# EAGLE design remote (EAGLE 9.2.2)
CNAME: Metronom - remote module; CREVISION: 2; DESIGNER: Piotr Wysocki
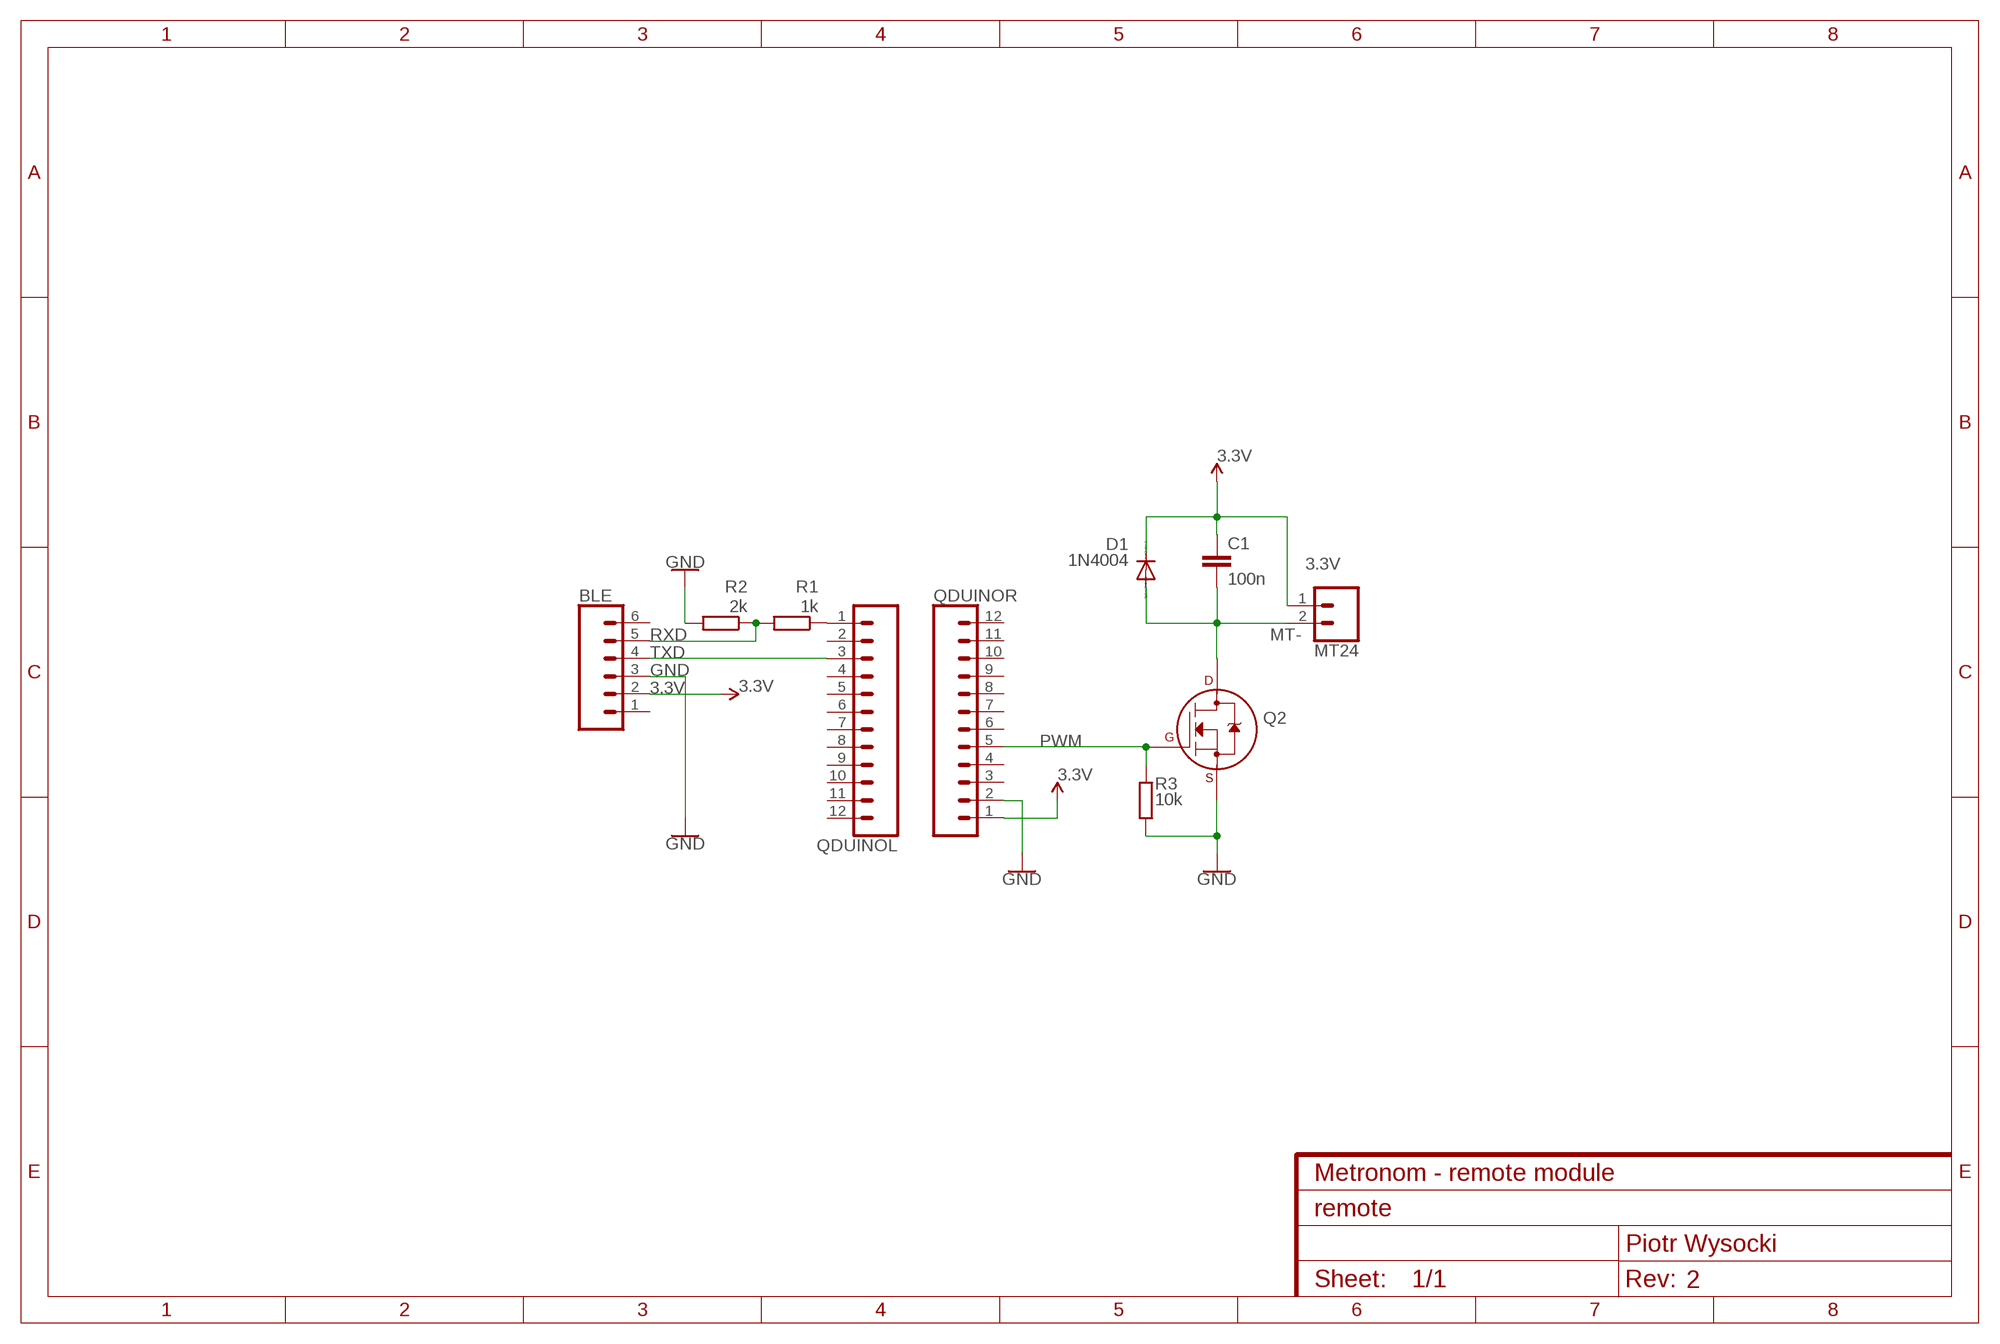
[diagram p0: schematic, sheet 1]

## Parts
BLE  CONN_06SILK_FEMALE_PTH  [1X06]
C1  100n  C-EU025-024X044  [C025-024X044]
D1  1N4004  [DO41-10]
MT24  CONN_02  [1X02]
Q2  2N7000_TO92  [TO-92]
QDUINOL  CONN_12  [1X12]
QDUINOR  CONN_12  [1X12]
R1  1k  R-EU_0204/7  [0204/7]
R2  2k  R-EU_0204/7  [0204/7]
R3  10k  R-EU_0204/7  [0204/7]

## Nets
3.3V: BLE.2 C1.1 D1.C MT24.1 QDUINOR.1
GND: BLE.3 Q2.1(S) QDUINOR.2 R2.2 R3.2
MT-: C1.2 D1.A MT24.2 Q2.3(D)
N$1: QDUINOL.1 R1.1
PWM: Q2.2(G) QDUINOR.5 R3.1
RXD: BLE.5 R1.2 R2.1
TXD: BLE.4 QDUINOL.3
Unconnected: BLE.1 BLE.6 QDUINOL.2 QDUINOL.4 QDUINOL.5 QDUINOL.6 QDUINOL.7 QDUINOL.8 QDUINOL.9 QDUINOL.10 QDUINOL.11 QDUINOL.12 QDUINOR.3 QDUINOR.4 QDUINOR.6 QDUINOR.7 QDUINOR.8 QDUINOR.9 QDUINOR.10 QDUINOR.11 QDUINOR.12

## Library data of the parts
BLE = SparkFun-Connectors:CONN_06: Multi connection point. Often used as Generic Header-pin footprint for 0.1 inch spaced/style header connections On any of the 0.1 inch spaced packages, you can populate with these: Break Away Headers - Straight <https://www.sparkfun.com/products/116> (PRT-00116) Break Away Male Headers - Right Angle <https://www.sparkfun.com/products/553> (PRT-00553) Female Headers <https://www.sparkfun.com/products/115> (PRT-00115) Break Away Headers - Machine Pin <https://www.sparkfun.com/products/117> (PRT-00117) Break Away Female Headers - Swiss Machine Pin <https://www.sparkfun.com/products/743> (PRT-00743) Arduino Stackable Header - 6 Pin <https://www.sparkfun.com/products/9280> (PRT-09280) For SCREWTERMINALS and SPRING TERMINALS visit here: Screw Terimnals on SparkFun.com <https://www.sparkfun.com/search/results?term=Screw+Terminals> (5mm/3.5mm/2.54mm spacing) This device is also useful as a general connection point to wire up your design to another part of your project. Our various solder wires solder well into these plated through hole pads. Hook-Up Wire - Assortment (Stranded, 22 AWG) <https://www.sparkfun.com/products/11375> (PRT-11375) Hook-Up Wire - Assortment (Solid Core, 22 AWG) <https://www.sparkfun.com/products/11367> (PRT-11367) View the entire wire category on our website here <https://www.sparkfun.com/categories/141>; PROD_ID: CONN-08437
C1 = rcl:C-EU: CAPACITOR, European symbol; SPICEPREFIX: C
D1 = diode:1N4004: DIODE general purpose rectifier, 1 A
MT24 = SparkFun-Connectors:CONN_02: Multi connection point. Often used as Generic Header-pin footprint for 0.1 inch spaced/style header connections On any of the 0.1 inch spaced packages, you can populate with these: Break Away Headers - Straight <https://www.sparkfun.com/products/116> (PRT-00116) Break Away Male Headers - Right Angle <https://www.sparkfun.com/products/553> (PRT-00553) Female Headers <https://www.sparkfun.com/products/115> (PRT-00115) Break Away Headers - Machine Pin <https://www.sparkfun.com/products/117> (PRT-00117) Break Away Female Headers - Swiss Machine Pin <https://www.sparkfun.com/products/743> (PRT-00743) For SCREWTERMINALS and SPRING TERMINALS visit here: Screw Terimnals on SparkFun.com <https://www.sparkfun.com/search/results?term=Screw+Terminals> (5mm/3.5mm/2.54mm spacing) This device is also useful as a general connection point to wire up your design to another part of your project. Our various solder wires solder well into these plated through hole pads. Hook-Up Wire - Assortment (Stranded, 22 AWG) <https://www.sparkfun.com/products/11375> (PRT-11375) Hook-Up Wire - Assortment (Solid Core, 22 AWG) <https://www.sparkfun.com/products/11367> (PRT-11367) View the entire wire category on our website here <https://www.sparkfun.com/categories/141> Special notes: Molex polarized connector foot print use with: PRT-08233 with associated crimp pins and housings. 2.54_SCREWTERM for use with PRT-10571. 3.5mm Screw Terminal footprints for PRT-08084 5mm Screw Terminal footprints for use with PRT-08432
Q2 = transistors:2N700*: 2N7000, 2N7002, NDS7002A N-channel enhancement mode MOSFET
QDUINOL QDUINOR = SparkFun-Connectors:CONN_12: Multi connection point. Often used as Generic Header-pin footprint for 0.1 inch spaced/style header connections On any of the 0.1 inch spaced packages, you can populate with these: Break Away Headers - Straight <https://www.sparkfun.com/products/116> (PRT-00116) Break Away Male Headers - Right Angle <https://www.sparkfun.com/products/553> (PRT-00553) Female Headers <https://www.sparkfun.com/products/115> (PRT-00115) Break Away Headers - Machine Pin <https://www.sparkfun.com/products/117> (PRT-00117) Break Away Female Headers - Swiss Machine Pin <https://www.sparkfun.com/products/743> (PRT-00743) For SCREWTERMINALS and SPRING TERMINALS visit here: Screw Terimnals on SparkFun.com <https://www.sparkfun.com/search/results?term=Screw+Terminals> (5mm/3.5mm/2.54mm spacing) This device is also useful as a general connection point to wire up your design to another part of your project. Our various solder wires solder well into these plated through hole pads. Hook-Up Wire - Assortment (Stranded, 22 AWG) <https://www.sparkfun.com/products/11375> (PRT-11375) Hook-Up Wire - Assortment (Solid Core, 22 AWG) <https://www.sparkfun.com/products/11367> (PRT-11367) View the entire wire category on our website here <https://www.sparkfun.com/categories/141> Special notes: Molex polarized connector foot print use with SKU : PRT-08231 with associated crimp pins and housings. 1MM SMD Version SKU: PRT-10208 NOTES ON THE VARIANTS LOCK and LOCK_LONGPADS... This footprint was designed to help hold the alignment of a through-hole component (i.e. 6-pin header) while soldering it into place. You may notice that each hole has been shifted either up or down by 0.005 of an inch from it's more standard position (which is a perfectly straight line). This slight alteration caused the pins (the squares in the middle) to touch the edges of the holes. Because they are alternating, it causes a "brace" to hold the component in place. 0.005 has proven to be the perfect amount of "off-center" position when using our standard breakaway headers. Although looks a little odd when you look at the bare footprint, once you have a header in there, the alteration is very hard to notice. Also,if you push a header all the way into place, it is covered up entirely on the bottom side.
R1-R3 = rcl:R-EU_: RESISTOR, European symbol; SPICEPREFIX: R

## Board
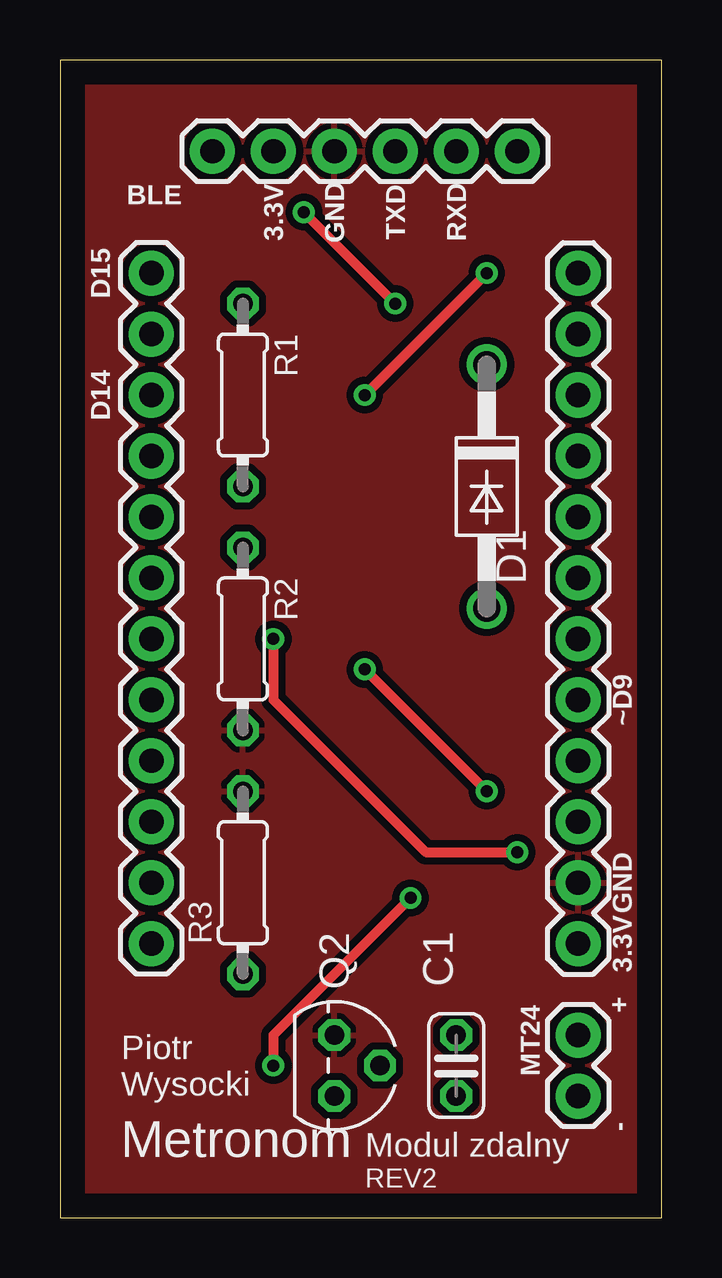
[diagram p1: board, top side]
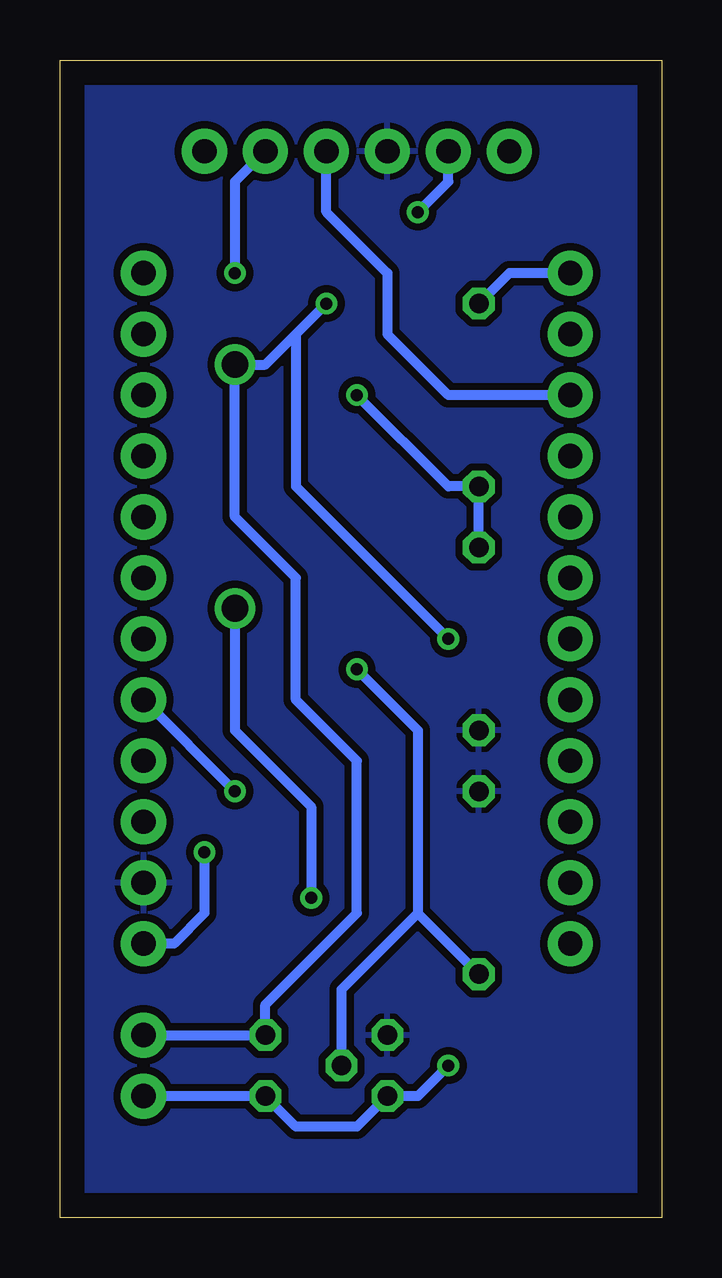
[diagram p2: board, bottom side, seen from below]

Size 25.07 x 48.25 mm. Coordinates in mm from the lower left corner, seen from the top.
Outline: 0,0 25.07,0 25.07,48.25 0,48.25 0,0
Copper layers (1*16): Top 0.035mm / dielectric 1.5mm / Bottom 0.035mm
Design rules "default": minimum track width 6mil, minimum drill 0.35mm, track to track 6mil, track to pad 6mil, pad to pad 6mil, via to via 6mil, smd to smd 6mil, copper to edge 40mil, drill to drill 6mil, minimum pad ring 10mil, minimum via ring 8mil, stop-mask expansion 4mil, vias tented up to drill 0mil, thermal gap 10mil

### Footprints (pad centres in the part's own frame; a part is rotated, then mirrored left to right if it is on the bottom)
1X06 = drill 1.016 pad 1.88: 1 0,0; 2 2.54,0; 3 5.08,0; 4 7.62,0; 5 10.16,0; 6 12.7,0
C025-024X044 = drill 0.813 octagon: 1 -1.27,0; 2 1.27,0
DO41-10 = drill 1.118: A 5.08,0; C -5.08,0
1X02 = drill 1.016 pad 1.88: 1 0,0; 2 2.54,0
TO-92 = drill 0.813 octagon: 1 -1.27,0; 2 0,1.905; 3 1.27,0
1X12 = drill 1.016 pad 1.88: 1 0,0; 2 2.54,0; 3 5.08,0; 4 7.62,0; 5 10.16,0; 6 12.7,0; 7 15.24,0; 8 17.78,0; 9 20.32,0; 10 22.86,0; 11 25.4,0; 12 27.94,0
0204/7 = drill 0.813 octagon: 1 -3.81,0; 2 3.81,0

### Placement (x,y rotation side)
BLE  6.35,44.45 0 top
C1  16.51,6.35 270 top
D1  17.78,30.48 270 top
MT24  21.59,7.62 270 top
Q2  11.43,6.35 270 top
QDUINOL  3.81,39.37 270 top
QDUINOR  21.59,11.43 90 top
R1  7.62,34.29 270 top
R2  7.62,24.13 270 top
R3  7.62,13.97 90 top

### Tracks (layer width: path | path; a pad name or v marks a point on that pad's centre or on a via)
3.3V  (via drill 0.5)
  Top 0.406: v13.97,38.1 v10.16,41.91 | v8.89,24.13 8.89,21.59 15.24,15.24 v19.05,15.24
  Bottom 0.406: v10.16,41.91 8.89,43.18 BLE.2 | v19.05,15.24 19.05,12.7 20.32,11.43 QDUINOR.1 | v8.89,24.13 15.24,30.48 15.24,36.83 | v13.97,38.1 15.24,36.83 | MT24.1 C1.1 16.51,8.89 12.7,12.7 12.7,19.05 15.24,21.59 15.24,26.67 17.78,29.21 D1.C 16.51,35.56 15.24,36.83
GND
  pour Top (isolate 0.305): -2.54,50.8 -2.54,-2.54 27.94,-2.54 27.94,50.8
  pour Bottom (isolate 0.305): -1.27,49.53 -1.27,-1.27 26.67,-1.27 26.67,49.53
MT-  (via drill 0.5)
  Top 0.406: v14.6,13.34 8.89,7.62 v8.89,6.35
  Bottom 0.406: D1.A 17.78,20.32 14.6,17.14 v14.6,13.34 | v8.89,6.35 10.16,5.08 Q2.3 12.7,3.81 15.24,3.81 C1.2 MT24.2
N$1
  Bottom 0.406: QDUINOL.1 6.35,39.37 R1.1
PWM  (via drill 0.5)
  Top 0.406: v17.78,17.78 v12.7,22.86
  Bottom 0.406: v17.78,17.78 QDUINOR.5 | v12.7,22.86 10.16,20.32 10.16,12.7 | 10.16,12.7 R3.1 | Q2.2 13.33,9.52 10.16,12.7
RXD  (via drill 0.5)
  Top 0.406: v17.78,39.37 v12.7,34.29
  Bottom 0.406: v12.7,34.29 8.89,30.48 R1.2 R2.1 | BLE.5 17.78,43.18 v17.78,39.37
TXD
  Bottom 0.406: QDUINOL.3 8.89,34.29 11.43,36.83 11.43,39.37 | 13.97,41.91 BLE.4 | 13.97,41.91 11.43,39.37 | 13.97,41.91 11.43,39.37

### Text on the board
tNames: 3.3V | GND | GND | TXD | RXD | D15 | D14 | ~D9 | GND | 3.3V | + | Piotr / Wysocki | - | Metronom | Modul zdalny | REV2